# Altium schematic sheet 001_Jetson_Nano.SchDoc: =title_line_1 + title_line_2
size 891 x 420 mm; SheetNumber: 1
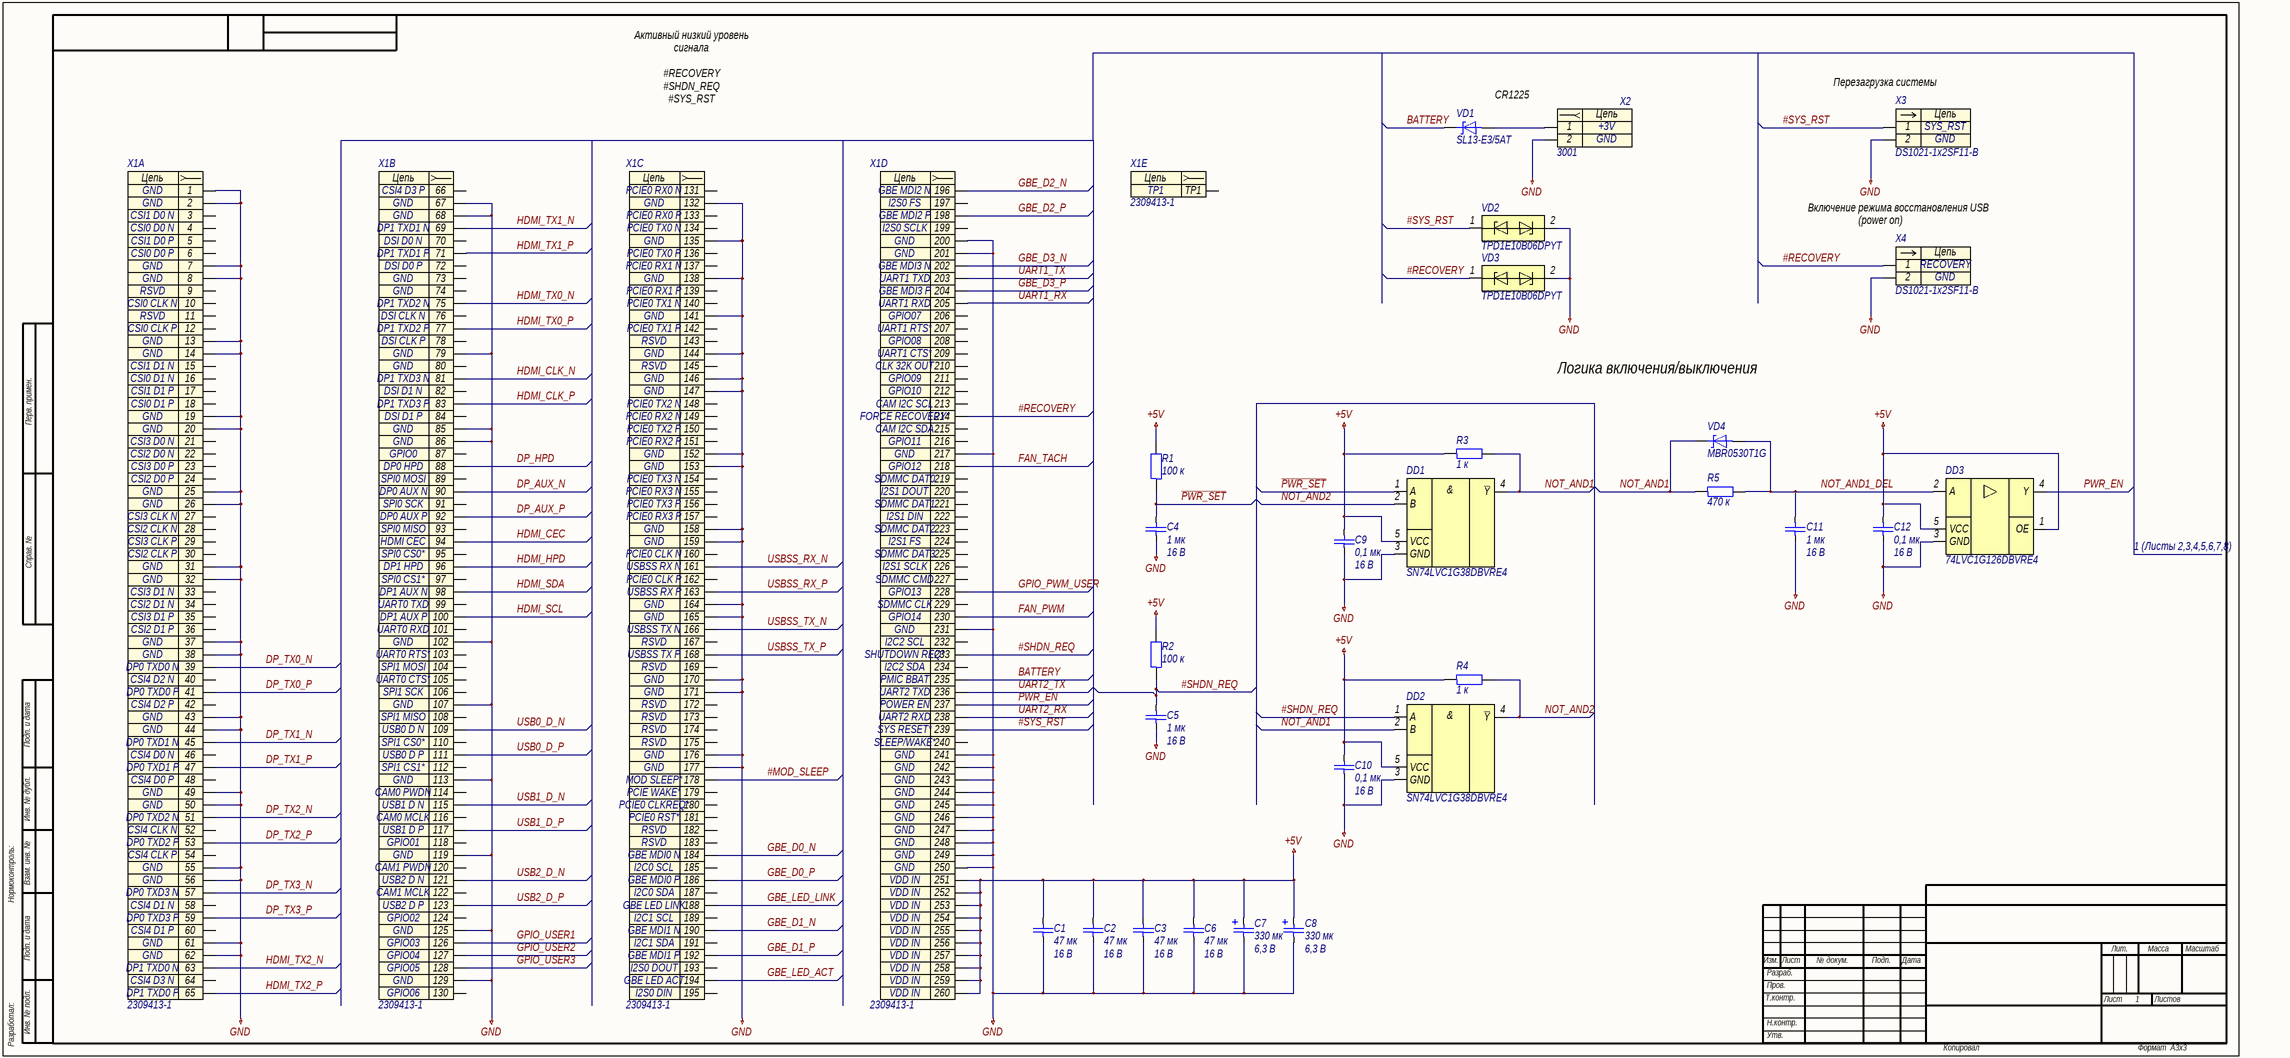
[diagram p0: 001_Jetson_Nano.SchDoc]

## Parts
C1  47 мк  Напряжение: 16 В  [C1206]
C2  47 мк  Напряжение: 16 В  [C1206]
C3  47 мк  Напряжение: 16 В  [C1206]
C4  1 мк  Напряжение: 16 В  [C0603]
C5  1 мк  Напряжение: 16 В  [C0603]
C6  47 мк  Напряжение: 16 В  [C1206]
C7  330 мк  Напряжение: 6,3 В  [C7343-31]
C8  330 мк  Напряжение: 6,3 В  [C7343-31]
C9  0,1 мк  Напряжение: 16 В  [C0603]
C10  0,1 мк  Напряжение: 16 В  [C0603]
C11  1 мк  Напряжение: 16 В  [C0603]
C12  0,1 мк  Напряжение: 16 В  [C0603]
DD1  SN74LVC1G38DBVRE4  [SOT-23-5-P95-290X280X145]
DD2  SN74LVC1G38DBVRE4  [SOT-23-5-P95-290X280X145]
DD3  74LVC1G126DBVRE4  [SOT-23-5-P95-290X280X145]
R1  100 к  [R0603]
R2  100 к  [R0603]
R3  1 к  [R0603]
R4  1 к  [R0603]
R5  470 к  [R0603]
VD1  SL13-E3/5AT  [DO-214AC-510X270X229]
VD2  TPD1E10B06DPYT  [X1SON-2-100X60X45]
VD3  TPD1E10B06DPYT  [X1SON-2-100X60X45]
VD4  MBR0530T1G  [SOD-123-368X160X135]
X1  2309413-1  [2309413-1]  (parts A,B,C,D,E of 5)
X2  3001  [3001]
X3  DS1021-1x2SF11-B  [DS1021-1X2SF11-B]
X4  DS1021-1x2SF11-B  [DS1021-1X2SF11-B]

## Nets
+5V: C1.1 C2.1 C3.1 C6.1 C7.1 C8.1 C9.1 C10.1 C12.1 DD1.5(VCC) DD2.5(VCC) DD3.1(OE) DD3.5(VCC) R1.2 R2.2 R3.1 R4.1 X1.251(VDD_IN) X1.252(VDD_IN) X1.253(VDD_IN) X1.254(VDD_IN) X1.255(VDD_IN) X1.256(VDD_IN) X1.257(VDD_IN) X1.258(VDD_IN) X1.259(VDD_IN) X1.260(VDD_IN)
GND: C1.2 C2.2 C3.2 C4.2 C5.2 C6.2 C7.2 C8.2 C9.2 C10.2 C11.2 C12.2 DD1.3(GND) DD2.3(GND) DD3.3(GND) VD2.2 VD3.2 X1.1(GND) X1.2(GND) X1.7(GND) X1.8(GND) X1.13(GND) X1.14(GND) X1.19(GND) X1.20(GND) X1.25(GND) X1.26(GND) X1.31(GND) X1.32(GND) X1.37(GND) X1.38(GND) X1.43(GND) X1.44(GND) X1.49(GND) X1.50(GND) X1.55(GND) X1.56(GND) X1.61(GND) X1.62(GND) X1.67(GND) X1.68(GND) X1.79(GND) X1.85(GND) X1.86(GND) X1.102(GND) X1.107(GND) X1.113(GND) X1.119(GND) X1.125(GND) X1.129(GND) X1.132(GND) X1.135(GND) X1.138(GND) X1.141(GND) X1.144(GND) X1.146(GND) X1.147(GND) X1.152(GND) X1.153(GND) X1.158(GND) X1.159(GND) X1.164(GND) X1.165(GND) X1.170(GND) X1.171(GND) X1.176(GND) X1.177(GND) X1.200(GND) X1.201(GND) X1.217(GND) X1.231(GND) X1.241(GND) X1.242(GND) X1.243(GND) X1.244(GND) X1.245(GND) X1.246(GND) X1.247(GND) X1.248(GND) X1.249(GND) X1.250(GND) X2.2 X3.2 X4.2
#MOD_SLEEP: X1.178(MOD_SLEEP*)
#RECOVERY: VD3.1 X1.214(FORCE_RECOVERY*) X4.1
#SHDN_REQ: C5.1 DD2.1(A) R2.1 X1.233(SHUTDOWN_REQ*)
#SYS_RST: VD2.1 X1.239(SYS_RESET*) X3.1
~{PWR_SET}: C4.1 DD1.1(A) R1.1
BATTERY: VD1.1 X1.235(PMIC_BBAT)
DP_AUX_N: X1.90(DP0_AUX_N)
DP_AUX_P: X1.92(DP0_AUX_P)
DP_HPD: X1.88(DP0_HPD)
DP_TX0_N: X1.39(DP0_TXD0_N)
DP_TX0_P: X1.41(DP0_TXD0_P)
DP_TX1_N: X1.45(DP0_TXD1_N)
DP_TX1_P: X1.47(DP0_TXD1_P)
DP_TX2_N: X1.51(DP0_TXD2_N)
DP_TX2_P: X1.53(DP0_TXD2_P)
DP_TX3_N: X1.57(DP0_TXD3_N)
DP_TX3_P: X1.59(DP0_TXD3_P)
FAN_PWM: X1.230(GPIO14)
FAN_TACH: X1.218(GPIO12)
GBE_D0_N: X1.184(GBE_MDI0_N)
GBE_D0_P: X1.186(GBE_MDI0_P)
GBE_D1_N: X1.190(GBE_MDI1_N)
GBE_D1_P: X1.192(GBE_MDI1_P)
GBE_D2_N: X1.196(GBE_MDI2_N)
GBE_D2_P: X1.198(GBE_MDI2_P)
GBE_D3_N: X1.202(GBE_MDI3_N)
GBE_D3_P: X1.204(GBE_MDI3_P)
GBE_LED_ACT: X1.194(GBE_LED_ACT)
GBE_LED_LINK: X1.188(GBE_LED_LINK)
GPIO_PWM_USER: X1.228(GPIO13)
GPIO_USER1: X1.126(GPIO03)
GPIO_USER2: X1.127(GPIO04)
GPIO_USER3: X1.128(GPIO05)
HDMI_CEC: X1.94(HDMI_CEC)
HDMI_CLK_N: X1.81(DP1_TXD3_N)
HDMI_CLK_P: X1.83(DP1_TXD3_P)
HDMI_HPD: X1.96(DP1_HPD)
HDMI_SCL: X1.100(DP1_AUX_P)
HDMI_SDA: X1.98(DP1_AUX_N)
HDMI_TX0_N: X1.75(DP1_TXD2_N)
HDMI_TX0_P: X1.77(DP1_TXD2_P)
HDMI_TX1_N: X1.69(DP1_TXD1_N)
HDMI_TX1_P: X1.71(DP1_TXD1_P)
HDMI_TX2_N: X1.63(DP1_TXD0_N)
HDMI_TX2_P: X1.65(DP1_TXD0_P)
NOT_AND1: DD1.4(~{Y}) DD2.2(B) R3.2 R5.1 VD4.1
NOT_AND1_DEL: C11.1 DD3.2(A) R5.2 VD4.2
NOT_AND2: DD1.2(B) DD2.4(~{Y}) R4.2
PWR_EN: DD3.4(Y) X1.237(POWER_EN)
UART1_RX: X1.205(UART1_RXD)
UART1_TX: X1.203(UART1_TXD)
UART2_RX: X1.238(UART2_RXD)
UART2_TX: X1.236(UART2_TXD)
USB0_D_N: X1.109(USB0_D_N)
USB0_D_P: X1.111(USB0_D_P)
USB1_D_N: X1.115(USB1_D_N)
USB1_D_P: X1.117(USB1_D_P)
USB2_D_N: X1.121(USB2_D_N)
USB2_D_P: X1.123(USB2_D_P)
USBSS_RX_N: X1.161(USBSS_RX_N)
USBSS_RX_P: X1.163(USBSS_RX_P)
USBSS_TX_N: X1.166(USBSS_TX_N)
USBSS_TX_P: X1.168(USBSS_TX_P)
NetVD1_2: VD1.2 X2.1

Not connected (* = marked no-connect by the designer): X1 3(CSI1_D0_N) 4(CSI0_D0_N) 5(CSI1_D0_P) 6(CSI0_D0_P) 9(RSVD) 10(CSI0_CLK_N) 11(RSVD) 12(CSI0_CLK_P) 15(CSI1_D1_N) 16(CSI0_D1_N) 17(CSI1_D1_P) 18(CSI0_D1_P) 21(CSI3_D0_N) 22(CSI2_D0_N) 23(CSI3_D0_P) 24(CSI2_D0_P) 27(CSI3_CLK_N) 28(CSI2_CLK_N) 29(CSI3_CLK_P) 30(CSI2_CLK_P) 33(CSI3_D1_N) 34(CSI2_D1_N) 35(CSI3_D1_P) 36(CSI2_D1_P) 40(CSI4_D2_N) 42(CSI4_D2_P) 46(CSI4_D0_N) 48(CSI4_D0_P) 52(CSI4_CLK_N) 54(CSI4_CLK_P) 58(CSI4_D1_N) 60(CSI4_D1_P) 64(CSI4_D3_N) 66(CSI4_D3_P) 70(DSI_D0_N) 72(DSI_D0_P) 73(GND) 74(GND) 76(DSI_CLK_N) 78(DSI_CLK_P) 80(GND) 82(DSI_D1_N) 84(DSI_D1_P) 87(GPIO0) 89(SPI0_MOSI) 91(SPI0_SCK) 93(SPI0_MISO) 95(SPI0_CS0*) 97(SPI0_CS1*) 99(UART0_TXD) 101(UART0_RXD) 103(UART0_RTS*) 104(SPI1_MOSI) 105(UART0_CTS*) 106(SPI1_SCK) 108(SPI1_MISO) 110(SPI1_CS0*) 112(SPI1_CS1*) 114(CAM0_PWDN) 116(CAM0_MCLK) 118(GPIO01) 120(CAM1_PWDN) 122(CAM1_MCLK) 124(GPIO02) 130(GPIO06) 131(PCIE0_RX0_N) 133(PCIE0_RX0_P) 134(PCIE0_TX0_N) 136(PCIE0_TX0_P) 137(PCIE0_RX1_N) 139(PCIE0_RX1_P) 140(PCIE0_TX1_N) 142(PCIE0_TX1_P) 143(RSVD) 145(RSVD) 148(PCIE0_TX2_N) 149(PCIE0_RX2_N) 150(PCIE0_TX2_P) 151(PCIE0_RX2_P) 154(PCIE0_TX3_N) 155(PCIE0_RX3_N) 156(PCIE0_TX3_P) 157(PCIE0_RX3_P) 160(PCIE0_CLK_N) 162(PCIE0_CLK_P) 167(RSVD) 169(RSVD) 172(RSVD) 173(RSVD) 174(RSVD) 175(RSVD) 179(PCIE_WAKE*) 180(PCIE0_CLKREQ*) 181(PCIE0_RST*) 182(RSVD) 183(RSVD) 185(I2C0_SCL) 187(I2C0_SDA) 189(I2C1_SCL) 191(I2C1_SDA) 193(I2S0_DOUT) 195(I2S0_DIN) 197(I2S0_FS) 199(I2S0_SCLK) 206(GPIO07) 207(UART1_RTS*) 208(GPIO08) 209(UART1_CTS*) 210(CLK_32K_OUT) 211(GPIO09) 212(GPIO10) 213(CAM_I2C_SCL) 215(CAM_I2C_SDA) 216(GPIO11) 219(SDMMC_DAT0) 220(I2S1_DOUT) 221(SDMMC_DAT1) 222(I2S1_DIN) 223(SDMMC_DAT2) 224(I2S1_FS) 225(SDMMC_DAT3) 226(I2S1_SCLK) 227(SDMMC_CMD) 229(SDMMC_CLK) 232(I2C2_SCL) 234(I2C2_SDA) 240(SLEEP/WAKE*) TP1

## Notes on the sheet
- Активный низкий уровень сигнала
  #RECOVERY
  #SHDN_REQ
  #SYS_RST
  #MOD_SLEEP
- CR1225
- Перезагрузка системы
- Включение режима восстановления USB
- (power on)
- Логика включения/выключения
- 1 (Листы 2,3,4,5,6,7,8)
- Перв. примен.
- Справ. №
- Подп. и дата
- Инв. № дубл.
- Нормоконтроль:
- Взам. инв. №
- Изм.
- Лист
- № докум.
- Подп.
- Дата
- Лит.
- Масса
- Масштаб
- Т.контр.
- Пров.
- Разраб.
- Листов
- Разработал:
- Инв. № подл.
- Н.контр.
- Утв.
- Копировал
- Формат
- А3х3
- (in symbol dd0001) &
- (in symbol x0017, part A) Цепь
- (in symbol x0017, part B) Цепь
- (in symbol x0017, part C) Цепь
- (in symbol x0017, part D) Цепь
- (in symbol x0017, part E) Цепь
- (in symbol x0025) Цепь
- (in symbol x0058) Цепь

## Library data of the parts
C1-C3 C6 = c0168: =Описание; ID: c0168; Фамилия: Паньков; Описание: Конденсатор керамический чип 1206 47 мкФ 16 В ±20 %; Наименование: CC1206MKX5R7BB476; Производитель: YAGEO Corp.; Отклонение: ±20 %; Рабочие температуры: от –55 °С до +85 °С; Температурный коэффициент емкости: X5R; Корпус: 1206; Номинал: 47 мк; Номинальное напряжение: 16 В; HelpURL: https://www.yageo.com/upload/media/product/productsearch/datasheet/mlcc/UPY-GPHC_X5R_4V-to-50V_26.pdf
C4 C5 C11 = c0113: =Описание; ID: c0113; Фамилия: Паньков; Описание: Конденсатор керамический чип 0603 1 мкФ 16 В ±10 %; Наименование: CC0603KRX7R7BB105; Производитель: YAGEO Corp.; Отклонение: ±10 %; Рабочие температуры: от –55 °С до +125 °С; Температурный коэффициент емкости: X7R; Корпус: 0603; Номинал: 1 мк; Номинальное напряжение: 16 В; HelpURL: https://www.yageo.com/upload/media/product/productsearch/datasheet/mlcc/UPY-GPHC_X7R_6.3V-to-50V_20.pdf
C7 C8 = c0173: =Описание; ID: c0173; Фамилия: Ларионов; Описание: Конденсатор электролитический чип 7343-31 330 мкФ 6,3 В ±20 %; Наименование: ECASD60J337M009KA0; Производитель: Murata Manufacturing Co., Ltd.; Отклонение: ±20 %; Эквивалентное последовательное сопротивление: 0,009 Ом; Среднеквадратичный размах пульсации тока: 3,5 А; Рабочие температуры: от –40 °С до +105 °С; Корпус: 7343-31; Номинал: 330 мк; Номинальное напряжение: 6,3 В; HelpURL: https://www.murata.com/en-us/products/productdetail?partno=ECASD60J337M009KA0
C9 C10 C12 = c0081: =Описание; ID: c0081; Фамилия: Паньков; Описание: Конденсатор керамический чип 0603 100 нФ 16 В ±10 %; Наименование: CC0603KRX7R7BB104; Производитель: YAGEO Corp.; Отклонение: ±10 %; Рабочие температуры: от –55 °С до +125 °С; Температурный коэффициент емкости: X7R; Корпус: 0603; Номинал: 0,1 мк; Номинальное напряжение: 16 В; HelpURL: https://www.yageo.com/upload/media/product/productsearch/datasheet/mlcc/UPY-GPHC_X7R_6.3V-to-50V_20.pdf
DD1 DD2 = dd0001: =Описание; ID: dd0001; Фамилия: Ларионов; Описание: Логический элемент И-НЕ 2 входа 1 выход; Производитель: Texas Instruments Inc.; Корпус: SOT-23-5; Наименование: SN74LVC1G38DBVRE4; HelpURL: https://www.ti.com/product/SN74LVC1G38
DD3 = dd0001: =Описание; ID: dd0001; Фамилия: Ларионов; Описание: Буферная микросхема 1 линия 3 состояния выхода; Производитель: Texas Instruments Inc.; Корпус: SOT-23-5; Наименование: 74LVC1G126DBVRE4; HelpURL: https://www.ti.com/product/SN74LVC1G126
R1 R2 = r0141: =Описание; ID: r0141; Фамилия: Водорезов; Описание: Резистор чип 0603 100 кОм ±1 % 0,1 Вт; Наименование: RC0603FR-07100KL; Производитель: YAGEO Corp.; Отклонение: ±1 %; Номинальное напряжение: 75 В; Номинальный ток: 1 А; Рабочие температуры: от –55 °С до +155 °С; Корпус: 0603; Примечание: Ряд E24; Номинал: 100 к; HelpURL: https://www.yageo.com/upload/media/product/productsearch/datasheet/rchip/PYu-RC_Group_51_RoHS_L_11.pdf
R3 R4 = r0076: =Описание; ID: r0076; Фамилия: Ларионов; Описание: Резистор чип 0603 1 кОм ±1 % 0,1 Вт; Наименование: RC0603FR-071KL; Производитель: YAGEO Corp.; Отклонение: ±1 %; Номинальное напряжение: 75 В; Номинальный ток: 1 А; Рабочие температуры: от –55 °С до +155 °С; Корпус: 0603; Примечание: Ряд E24; Номинал: 1 к; HelpURL: https://www.yageo.com/upload/media/product/productsearch/datasheet/rchip/PYu-RC_Group_51_RoHS_L_11.pdf
R5 = r0164: =Описание; ID: r0164; Фамилия: Паньков; Описание: Резистор чип 0603 470 кОм ±1 % 0,1 Вт; Наименование: RC0603FR-07470KL; Производитель: YAGEO Corp.; Отклонение: ±1 %; Номинальное напряжение: 75 В; Номинальный ток: 1 А; Рабочие температуры: от –55 °С до +155 °С; Корпус: 0603; Примечание: Ряд E24; Номинал: 470 к; HelpURL: https://www.yageo.com/upload/media/product/productsearch/datasheet/rchip/PYu-RC_Group_51_RoHS_L_11.pdf
VD1 = vd0003: =Описание; ID: vd0003; Фамилия: Ларионов; Описание: Диод Шоттки 30 В 1,5 А; Производитель: Vishay Intertechnology, Inc.; Максимальное прямое напряжение: 0,445 В; Максимальное обратное напряжение: 30 В; Максимальный прямой ток: 1,5 А; Рабочие температуры: от –55 °С до +125 °С; Корпус: DO-214AC; Наименование: SL13-E3/5AT; HelpURL: https://www.vishay.com/product?docid=88740
VD2 VD3 = vd0013: =Описание; ID: vd0013; Фамилия: Ларионов; Описание: Двунаправленная диодная сборка для подавления помех 5,5 В; Производитель: Texas Instruments Inc.; Корпус: X1SON-2; Наименование: TPD1E10B06DPYT; HelpURL: https://www.ti.com/product/TPD1E10B06
VD4 = vd0001: =Описание; ID: vd0001; Фамилия: Шкабара; Описание: Диод Шоттки 30 В 0,5 А; Производитель: ON Semiconductor; Максимальное прямое напряжение: 0,43 В; Максимальное обратное напряжение: 30 В; Максимальный прямой ток: 0,5 А; Рабочие температуры: от –65 °С до +125 °С; Корпус: SOD-123; Наименование: MBR0530T1G; HelpURL: https://www.onsemi.com/products/discretes-drivers/diodes-rectifiers/schottky-diodes-schottky-rectifiers/mbr0530t1g
X1 = x0017: =Описание; Contact_001: GND; Contact_003: CSI1 D0 N; Contact_004: CSI0 D0 N; Contact_005: CSI1 D0 P; Contact_006: CSI0 D0 P; Contact_010: CSI0 CLK N; Contact_011: RSVD; Contact_012: CSI0 CLK P; Contact_015: CSI1 D1 N; Contact_016: CSI0 D1 N; Contact_017: CSI1 D1 P; Contact_030: CSI2 CLK P; Contact_036: CSI2 D1 P; Contact_039: DP0 TXD0 N; Contact_040: CSI4 D2 N; Contact_018: CSI0 D1 P; Contact_021: CSI3 D0 N; Contact_022: CSI2 D0 N; Contact_023: CSI3 D0 P; Contact_024: CSI2 D0 P; Contact_027: CSI3 CLK N; Contact_028: CSI2 CLK N; Contact_029: CSI3 CLK P; Contact_033: CSI3 D1 N; Contact_034: CSI2 D1 N; Contact_035: CSI3 D1 P; Contact_041: DP0 TXD0 P; Contact_052: CSI4 CLK N; Contact_063: DP1 TXD0 N; Contact_069: DP1 TXD1 N; Contact_070: DSI D0 N; Contact_071: DP1 TXD1 P; Contact_072: DSI D0 P; Contact_042: CSI4 D2 P; Contact_045: DP0 TXD1 N; Contact_046: CSI4 D0 N; Contact_047: DP0 TXD1 P; Contact_048: CSI4 D0 P; Contact_051: DP0 TXD2 N; Contact_053: DP0 TXD2 P; Contact_054: CSI4 CLK P; Contact_057: DP0 TXD3 N; Contact_058: CSI4 D1 N; Contact_059: DP0 TXD3 P; Contact_060: CSI4 D1 P; Contact_064: CSI4 D3 N; Contact_065: DP1 TXD0 P; Contact_066: CSI4 D3 P; Contact_075: DP1 TXD2 N; Contact_076: DSI CLK N; Contact_077: DP1 TXD2 P; Contact_078: DSI CLK P; Contact_081: DP1 TXD3 N; Contact_082: DSI D1 N; Contact_083: DP1 TXD3 P; Contact_084: DSI D1 P; Contact_087: GPIO0; Contact_088: DP0 HPD; Contact_089: SPI0 MOSI; Contact_090: DP0 AUX N; Contact_091: SPI0 SCK; Contact_092: DP0 AUX P; Contact_093: SPI0 MISO; Contact_094: HDMI CEC; Contact_095: SPI0 CS0*; Contact_096: DP1 HPD; Contact_097: SPI0 CS1*; Contact_098: DP1 AUX N; Contact_099: UART0 TXD; Contact_100: DP1 AUX P; Contact_101: UART0 RXD; Contact_103: UART0 RTS*; Contact_104: SPI1 MOSI; Contact_105: UART0 CTS*; Contact_106: SPI1 SCK; Contact_108: SPI1 MISO; Contact_109: USB0 D N; Contact_110: SPI1 CS0*; Contact_111: USB0 D P; Contact_112: SPI1 CS1*; Contact_114: CAM0 PWDN; Contact_115: USB1 D N; Contact_116: CAM0 MCLK; Contact_117: USB1 D P; Contact_118: GPIO01; Contact_120: CAM1 PWDN; Contact_121: USB2 D N; Contact_122: CAM1 MCLK; Contact_123: USB2 D P; Contact_124: GPIO02; Contact_126: GPIO03; Contact_127: GPIO04; Contact_128: GPIO05; Contact_130: GPIO06; Contact_131: PCIE0 RX0 N; Contact_133: PCIE0 RX0 P; Contact_134: PCIE0 TX0 N; Contact_136: PCIE0 TX0 P; Contact_137: PCIE0 RX1 N; Contact_139: PCIE0 RX1 P; Contact_140: PCIE0 TX1 N; Contact_142: PCIE0 TX1 P; Contact_148: PCIE0 TX2 N; Contact_149: PCIE0 RX2 N; Contact_150: PCIE0 TX2 P; Contact_151: PCIE0 RX2 P; Contact_154: PCIE0 TX3 N; Contact_155: PCIE0 RX3 N; Contact_156: PCIE0 TX3 P; Contact_157: PCIE0 RX3 P; Contact_160: PCIE0 CLK N; Contact_161: USBSS RX N; Contact_162: PCIE0 CLK P; Contact_163: USBSS RX P; Contact_166: USBSS TX N; Contact_168: USBSS TX P; Contact_178: MOD SLEEP*; Contact_179: PCIE WAKE*; Contact_180: PCIE0 CLKREQ*; Contact_181: PCIE0 RST*; Contact_184: GBE MDI0 N; Contact_185: I2C0 SCL; Contact_186: GBE MDI0 P; Contact_187: I2C0 SDA; Contact_188: GBE LED LINK; Contact_189: I2C1 SCL; Contact_190: GBE MDI1 N; Contact_191: I2C1 SDA; Contact_192: GBE MDI1 P; Contact_193: I2S0 DOUT; Contact_194: GBE LED ACT; Contact_195: I2S0 DIN; Contact_196: GBE MDI2 N; Contact_197: I2S0 FS; Contact_198: GBE MDI2 P; Contact_199: I2S0 SCLK; Contact_202: GBE MDI3 N; Contact_203: UART1 TXD; Contact_204: GBE MDI3 P; Contact_205: UART1 RXD; Contact_206: GPIO07; Contact_207: UART1 RTS*; Contact_208: GPIO08; Contact_209: UART1 CTS*; Contact_210: CLK 32K OUT; Contact_211: GPIO09; Contact_212: GPIO10; Contact_213: CAM I2C SCL; Contact_214: FORCE RECOVERY*; Contact_215: CAM I2C SDA; Contact_216: GPIO11; Contact_218: GPIO12; Contact_219: SDMMC DAT0; Contact_220: I2S1 DOUT; Contact_221: SDMMC DAT1; Contact_222: I2S1 DIN; Contact_223: SDMMC DAT2; Contact_224: I2S1 FS; Contact_225: SDMMC DAT3; Contact_226: I2S1 SCLK; Contact_227: SDMMC CMD; Contact_228: GPIO13; Contact_229: SDMMC CLK; Contact_230: GPIO14; Contact_232: I2C2 SCL; Contact_233: SHUTDOWN REQ*; Contact_234: I2C2 SDA; Contact_235: PMIC BBAT; Contact_236: UART2 TXD; Contact_237: POWER EN; Contact_238: UART2 RXD; Contact_239: SYS RESET*; Contact_240: SLEEP/WAKE*; Contact_251: VDD IN; ID: x0017; Фамилия: Ларионов; Описание: SO DIMM 260 pin высота 9,2 мм гнездо угловой; Производитель: TE Connectivity; Contact_002: GND; Contact_007: GND; Contact_008: GND; Contact_013: GND; Contact_014: GND; Contact_009: RSVD; Contact_019: GND; Contact_037: GND; Contact_038: GND; Contact_020: GND; Contact_025: GND; Contact_026: GND; Contact_031: GND; Contact_032: GND; Contact_067: GND; Contact_068: GND; Contact_043: GND; Contact_044: GND; Contact_049: GND; Contact_050: GND; Contact_055: GND; Contact_056: GND; Contact_061: GND; Contact_062: GND; Contact_073: GND; Contact_074: GND; Contact_079: GND; Contact_080: GND; Contact_085: GND; Contact_086: GND; Contact_102: GND; Contact_107: GND; Contact_113: GND; Contact_119: GND; Contact_125: GND; Contact_129: GND; Contact_132: GND; Contact_135: GND; Contact_138: GND; Contact_141: GND; Contact_143: RSVD; Contact_144: GND; Contact_145: RSVD; Contact_146: GND; Contact_147: GND; Contact_152: GND; Contact_153: GND; Contact_158: GND; Contact_159: GND; Contact_164: GND; Contact_165: GND; Contact_167: RSVD; Contact_169: RSVD; Contact_170: GND; Contact_171: GND; Contact_172: RSVD; Contact_173: RSVD; Contact_174: RSVD; Contact_175: RSVD; Contact_176: GND; Contact_177: GND; Contact_182: RSVD; Contact_183: RSVD; Contact_200: GND; Contact_201: GND; Contact_217: GND; Contact_231: GND; Contact_241: GND; Contact_242: GND; Contact_243: GND; Contact_244: GND; Contact_245: GND; Contact_246: GND; Contact_247: GND; Contact_248: GND; Contact_249: GND; Contact_250: GND; Contact_252: VDD IN; Contact_253: VDD IN; Contact_254: VDD IN; Contact_255: VDD IN; Contact_256: VDD IN; Contact_257: VDD IN; Contact_258: VDD IN; Contact_259: VDD IN; Contact_260: VDD IN; TP1: TP1; Наименование: 2309413-1; HelpURL: https://www.te.com/usa-en/product-2309413-1.html
X2 = x0058: =Описание; Contact_1: +3V; Contact_2: GND; ID: x0058; Фамилия: Ларионов; Описание: Battery Holder CR1225 2 pin гнездо; Производитель: Keystone Electronics Corp.; Наименование: 3001; HelpURL: https://www.keyelco.com/product.cfm/product_id/778
X3 = x0025: =Описание; Contact_1: SYS_RST; Contact_2: GND; ID: x0025; Фамилия: Паньков; Описание: PLS 2 pin 2,54 мм вилка прямой; Производитель: Connfly Electronic Co., Ltd.; Наименование: DS1021-1x2SF11-B; HelpURL: http://en.connfly.group/product/xVkr=EusQssAN0gN=Aos=mU+UrVkR9kqEAN0gN9g+WqANB+A
X4 = x0025: =Описание; Contact_1: RECOVERY; Contact_2: GND; ID: x0025; Фамилия: Паньков; Описание: PLS 2 pin 2,54 мм вилка прямой; Производитель: Connfly Electronic Co., Ltd.; Наименование: DS1021-1x2SF11-B; HelpURL: http://en.connfly.group/product/xVkr=EusQssAN0gN=Aos=mU+UrVkR9kqEAN0gN9g+WqANB+A